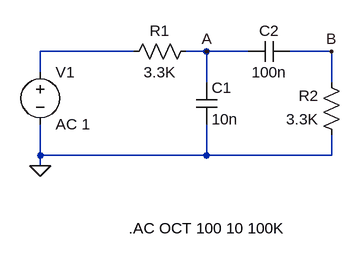
[diagram p0: schematic passabanda AC.asc]
passabanda AC.asc, the LTspice schematic file:
Version 4
SHEET 1 880 680
WIRE 32 112 -112 112
WIRE 144 112 112 112
WIRE 208 112 144 112
WIRE 336 112 272 112
WIRE -112 144 -112 112
WIRE 144 160 144 112
WIRE 336 160 336 112
WIRE -112 272 -112 224
WIRE 144 272 144 224
WIRE 144 272 -112 272
WIRE 336 272 336 240
WIRE 336 272 144 272
WIRE -112 288 -112 272
FLAG -112 288 0
FLAG 144 112 A
FLAG 336 112 B
SYMBOL voltage -112 128 R0
SYMATTR InstName V1
SYMATTR Value AC 1
SYMBOL res 128 96 R90
WINDOW 0 0 56 VBottom 2
WINDOW 3 32 56 VTop 2
SYMATTR InstName R1
SYMATTR Value 3.3K
SYMBOL res 352 256 R180
WINDOW 0 36 76 Left 2
WINDOW 3 36 40 Left 2
SYMATTR InstName R2
SYMATTR Value 3.3K
SYMBOL cap 128 160 R0
SYMATTR InstName C1
SYMATTR Value 10n
SYMBOL cap 272 96 R90
WINDOW 0 0 32 VBottom 2
WINDOW 3 32 32 VTop 2
SYMATTR InstName C2
SYMATTR Value 100n
TEXT 24 384 Left 2 !.AC OCT 100 10 100K

The netlist it stands for:
* passabanda AC.asc
V1 N001 0 AC 1
R1 A N001 3.3K
R2 0 B 3.3K
C1 A 0 10n
C2 B A 100n
.AC OCT 100 10 100K
.backanno
.end